# Altium schematic sheet LCD_LED.SchDoc: Air724UG 参考设计
size 594 x 419 mm; DESIGNER: Loukanghua; REV: V1.0
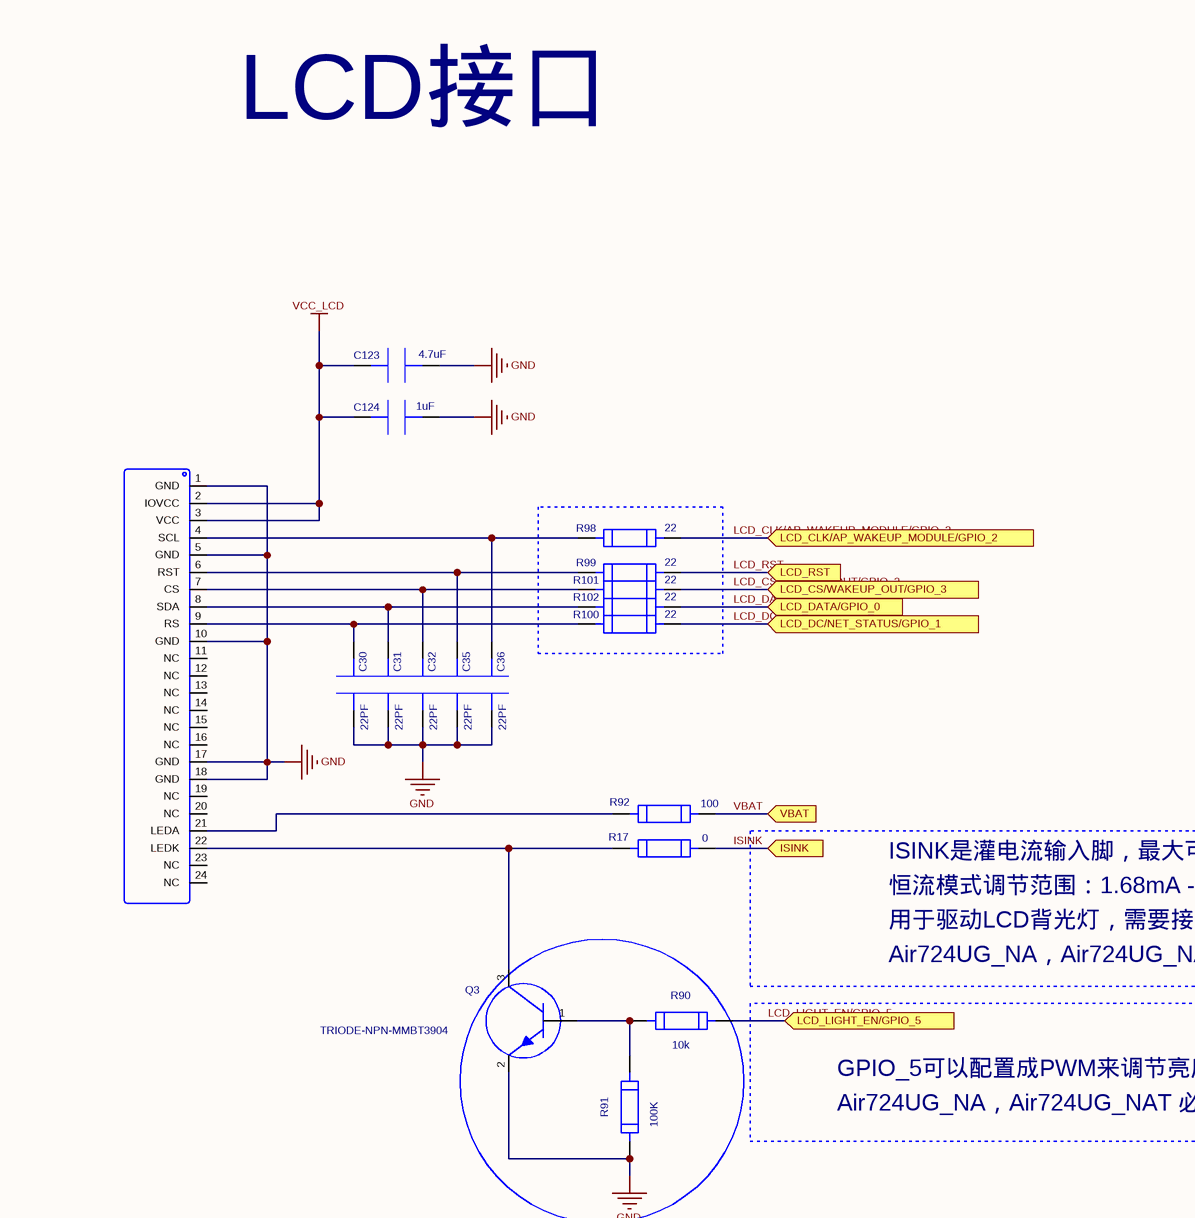
[diagram p0: LCD_LED.SchDoc, top left]
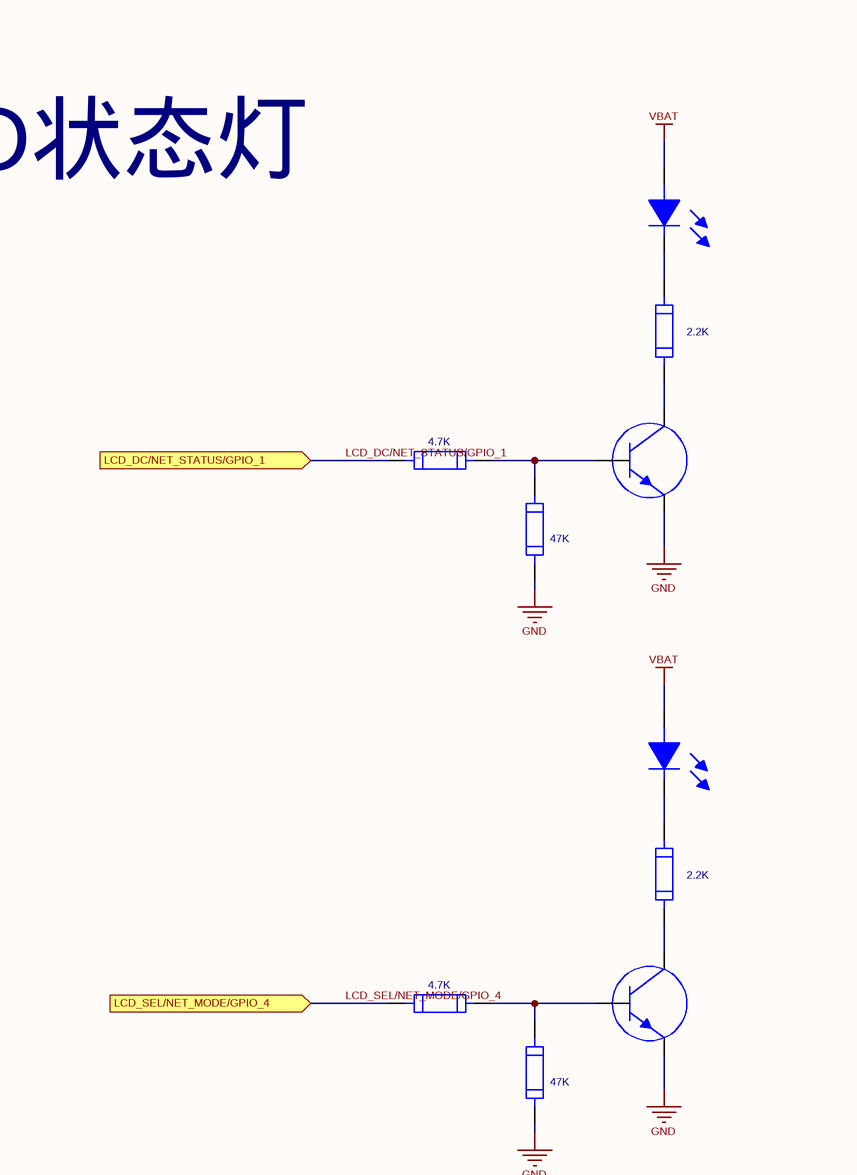
[diagram p1: LCD_LED.SchDoc, top right]
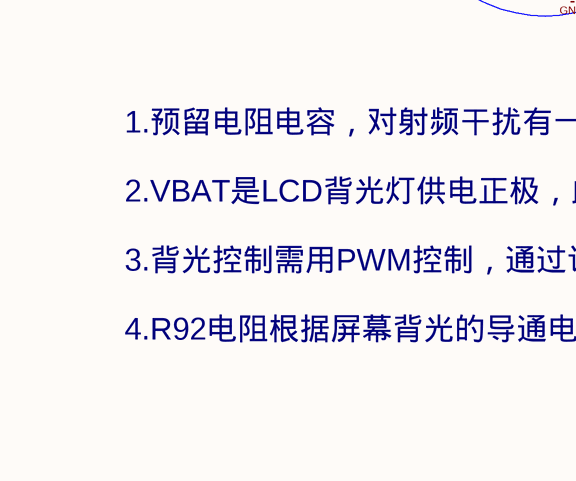
[diagram p2: LCD_LED.SchDoc, bottom left]
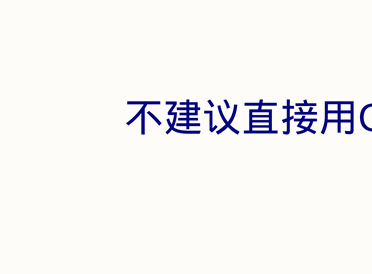
[diagram p3: LCD_LED.SchDoc, bottom middle]
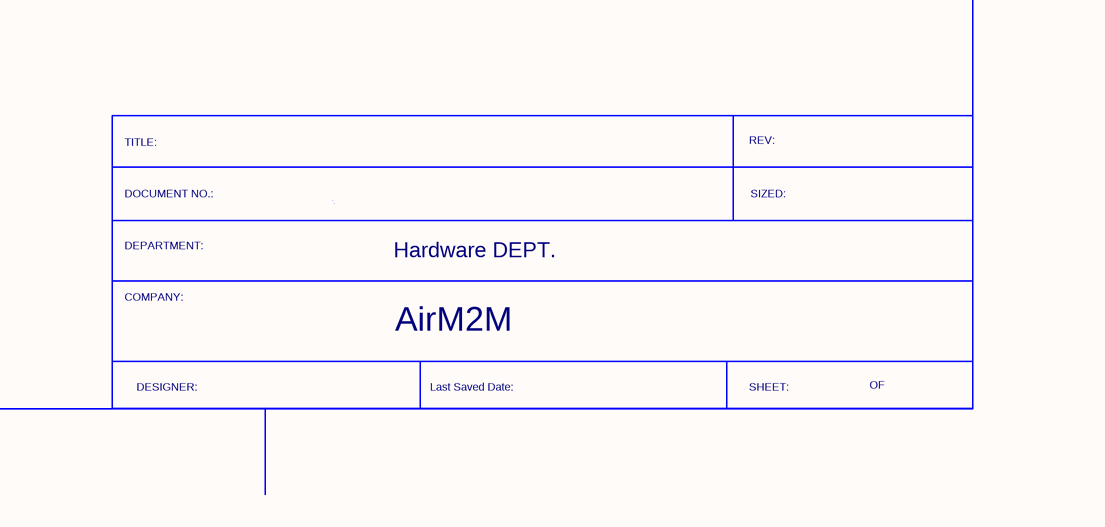
[diagram p4: LCD_LED.SchDoc, bottom right]

## Parts
C30  value 22PF  [SC0402]  (hidden comment: CAP-22PF-0402-C0G)
C31  value 22PF  [SC0402]  (hidden comment: CAP-22PF-0402-C0G)
C32  value 22PF  [SC0402]  (hidden comment: CAP-22PF-0402-C0G)
C35  value 22PF  [SC0402]  (hidden comment: CAP-22PF-0402-C0G)
C36  value 22PF  [SC0402]  (hidden comment: CAP-22PF-0402-C0G)
C123  value 4.7uF  [SC0603]  (hidden comment: CAP-4.7UF-0603-X5R)
C124  value 1uF  [SC0402]  (hidden comment: CAP-1UF-0402-X5R)
D1  DIODE-LED-RED-2.54  [DIP2X1-2.54]  (value not drawn)
D3  DIODE-LED-RED-2.54  [DIP2X1-2.54]  (value not drawn)
P6  FPC_0.5MM_24P_PULL_TYPE_H2.0MM_UNDER_THE  [FPC-SMD_AFC07-S24FCC-00]  (value not drawn)
Q3  TRIODE-NPN-MMBT3904  [SOT-23(MMBT3904)]
Q5  TRIODE-NPN-MMBT3904  [SOT-23(MMBT3904)]  (value not drawn)
Q6  TRIODE-NPN-MMBT3904  [SOT-23(MMBT3904)]  (value not drawn)
R17  value 0  [SR0402]  (hidden comment: RES-0-0402)
R24  value 4.7K  [SR0402]  (hidden comment: RES-4.7K-0402)
R30  value 47K  [SR0402]  (hidden comment: RES-4.7K-0402)
R31  value 2.2K  [SR0402]  (hidden comment: RES-4.7K-0402)
R32  value 4.7K  [SR0402]  (hidden comment: RES-4.7K-0402)
R33  value 47K  [SR0402]  (hidden comment: RES-4.7K-0402)
R34  value 2.2K  [SR0402]  (hidden comment: RES-4.7K-0402)
R90  value 10k  [SR0402]  (hidden comment: RES-10K-0402)
R91  value 100K  [SR0402]  (hidden comment: RES-100K-0402)
R92  value 100  [SR0603]  (hidden comment: RES-100-0603)
R98  value 22  [SR0402]  (hidden comment: RES-22-0402)
R99  value 22  [SR0402]  (hidden comment: RES-22-0402)
R100  value 22  [SR0402]  (hidden comment: RES-22-0402)
R101  value 22  [SR0402]  (hidden comment: RES-22-0402)
R102  value 22  [SR0402]  (hidden comment: RES-22-0402)

## Blocks framed on the sheet
LCD接口: C30-C32 C35 C36 C123 C124 P6 Q3 R17 R90-R92 R98-R102
LED状态灯: D1 D3 Q5 Q6 R24 R30-R34

## Ports
ISINK, LCD_CLK/AP_WAKEUP_MODULE/GPIO_2, LCD_CS/WAKEUP_OUT/GPIO_3, LCD_DATA/GPIO_0, LCD_DC/NET_STATUS/GPIO_1, LCD_LIGHT_EN/GPIO_5, LCD_RST, LCD_SEL/NET_MODE/GPIO_4, VBAT

## Nets
GND: C30.2 C31.2 C32.2 C35.2 C36.2 C123.1 C124.1 P6.1(GND) P6.5(GND) P6.10(GND) P6.17(GND) P6.18(GND) Q3.2 Q5.2 Q6.2 R30.1 R33.1 R91.1
VBAT: D1.1 D3.1 R92.1 ; port VBAT
VCC_LCD: C123.2 C124.2 P6.2(IOVCC) P6.3(VCC)
ISINK: R17.2 ; port ISINK
LCD_CLK/AP_WAKEUP_MODULE/GPIO_2: R98.2 ; port LCD_CLK/AP_WAKEUP_MODULE/GPIO_2
LCD_CS/WAKEUP_OUT/GPIO_3: R101.2 ; port LCD_CS/WAKEUP_OUT/GPIO_3
LCD_DATA/GPIO_0: R102.2 ; port LCD_DATA/GPIO_0
LCD_DC/NET_STATUS/GPIO_1: R32.1 R100.2 ; port LCD_DC/NET_STATUS/GPIO_1
LCD_LIGHT_EN/GPIO_5: R90.2 ; port LCD_LIGHT_EN/GPIO_5
LCD_RST: R99.2 ; port LCD_RST
LCD_SEL/NET_MODE/GPIO_4: R24.1 ; port LCD_SEL/NET_MODE/GPIO_4
NetC30_1: C30.1 P6.9(RS) R100.1
NetC31_1: C31.1 P6.8(SDA) R102.1
NetC32_1: C32.1 P6.7(CS) R101.1
NetC35_1: C35.1 P6.6(RST) R99.1
NetC36_1: C36.1 P6.4(SCL) R98.1
NetD1_2: D1.2 R31.2
NetD3_2: D3.2 R34.2
NetP6_21: P6.21(LEDA) R92.2
NetP6_22: P6.22(LEDK) Q3.3 R17.1
NetQ3_1: Q3.1 R90.1 R91.2
NetQ5_1: Q5.1 R32.2 R33.2
NetQ5_3: Q5.3 R34.1
NetQ6_1: Q6.1 R24.2 R30.2
NetQ6_3: Q6.3 R31.1

Not connected (* = marked no-connect by the designer): P6 11(NC) 12(NC) 13(NC) 14(NC) 15(NC) 16(NC) 19(NC) 20(NC) 23(NC) 24(NC)

## Notes on the sheet
- ISINK是灌电流输入脚，最大可提供电流100mA，电流可调节
- 用于驱动LCD背光灯，需要接背光灯的负极
- 恒流模式调节范围：1.68mA - 54.6mA
- Air724UG_NA，Air724UG_NAT 不支持这个功能
- GPIO_5可以配置成PWM来调节亮度
- Air724UG_NA，Air724UG_NAT 必须加
- 1.预留电阻电容，对射频干扰有一定的抑制效果；
- 不建议直接用GPIO驱动LED，需要加三极管来驱动
- 2.VBAT是LCD背光灯供电正极，此电源可根据LCD模组的需求，自行设计。
- 3.背光控制需用PWM控制，通过调整PWM占空比来调整背光亮度；
- 4.R92电阻根据屏幕背光的导通电流来做调整。
- TITLE:
- REV:
- DEPARTMENT:
- DOCUMENT NO.:
- Hardware DEPT.
- SIZED:
- COMPANY:
- AirM2M
- DESIGNER:
- Last Saved Date:
- SHEET:
- OF

## Library data of the parts
C30-C32 C35 C36 = CAP-22PF-0402-C0G: CAP CER C0G;22PF;+/-5%;50V;0402;0.5mm;ROHS; Manufacture 1: MURATA;Yageo;Eyang; Manufacture 1 P/N: GRM1555C1H220J****;CC0402JRNPO9BN220;C0402C0G220J500N*; Geometry.Height: 0.55mm; Serial Number: 80214650007; Tolerance: +/-5%;; PCB DECAL: SC0402
C123 = CAP-4.7UF-0603-X5R: CAP CER X5R;4.7uF;+/-10%;6.3V;0603;0.8mm;ROHS; Manufacture 1: Murata;TDK;Yageo;Taiyo Yuden;Panasonic;Kyocera;Samsung;; Manufacture 1 P/N: GRM188R60J475K****;C1608X5R0J475K;CC0603KRX5R5BB475;JMK107BJ475KA-T;ECJ1VB0J475K;CV105X5R475K06ATCL10A475KQ8NNNC;; Geometry.Height: 0.95mm; Serial Number: 80216710002; Tolerance: +/-10%; PCB DECAL: SC0603
C124 = CAP-1UF-0402-X5R: CAP CER X5R;1uF;+/-10%;6.3V;0402;0.5mm;ROHS; Manufacture 1 P/N: GRM155R60J105K****;CC0402KRX5R5BB105;C1005X5R0J105KT;JMK105BJ105KV-F;ECJ0EB0J105K;0402X105K6R3CT;CL05A105KQ5NNNC; Manufacture 1: Murata;Yageo;TDK;Taiyo Yuden;Panasonic;Walsin;Samsung; Serial Number: 80214710001; Geometry.Height: 0.55mm; Tolerance: +/-10%; PCB DECAL: SC0402
D1 D3 = DIODE-LED-RED-2.54: LED red; PCB DECAL: DIP2X1-2.54
P6 = FPC_0.5MM_24P_PULL_TYPE_H2.0MM_UNDER_THE: BOM_Manufacturer_Part: FPC 0.5MM 24P Pull type H2.0mm Under the next; BOM_Manufacturer: ReliaPro; spiceSymbolName: FPC 0.5MM 24P Pull type H2.0mm Under the next; BOM_Supplier_Part: C11057; image: //image.lceda.cn/szlcsc/C11057.jpg; BOM_Supplier: LCSC; spicePre: X; PCB DECAL: FPC-SMD_AFC07-S24FCC-00
Q3 Q5 Q6 = TRIODE-NPN-MMBT3904: Transistor;NPN;40V;200mA;SOT23;1.1mm;ROHS; Manufacture 1: 长电; Serial Number: 81232000008; Geometry.Height: 1.1mm; Manufacture 1 P/N: MMBT3904; PCB DECAL: SOT-23(MMBT3904)
R17 = RES-0-0402: RES FILM;0;1A;0402;0.4mm;ROHS; Manufacture 1: YAGEO; Manufacture 1 P/N: RC0402JR-070RL; Serial Number: 80114640001; Geometry.Height: 0.4mm; PCB DECAL: SR0402
R24 R30-R34 = RES-4.7K-0402: RES FILM;4.7K;+/-5%;1/16W;0402;0.4mm;ROHS; Manufacture 1: YAGEO; Manufacture 1 P/N: RC0402JR-074K7L; Serial Number: 80114640017; Geometry.Height: 0.4mm; Tolerance: +/-5%; PCB DECAL: SR0402
R90 = RES-10K-0402: RES FILM;10K;+/-5%;1/16W;0402;0.4mm;ROHS; Manufacture 1: YAGEO;Walsin; Manufacture 1 P/N: RC0402JR-0710KL;WR04X103_JTL; Designator: R; Serial Number: 80114640004; Package: 0402; PCB DECAL: SR0402; Geometry.Height: 0.4mm; Tolerance: +/-5%
R91 = RES-100K-0402: RES FILM;100K;+/-5%;1/16W;0402;0.4mm;ROHS; Manufacture 1 P/N: RC0402JR-07100KL;WR04X104_JTL;; Manufacture 1: YAGEO;Walsin; Geometry.Height: 0.40mm; Serial Number: 80114640005; Tolerance: +/-5%; PCB DECAL: SR0402
R92 = RES-100-0603: RES FILM;100;+/-5%;1/10W;0603;0.55mm;ROHS; Manufacture 1: YAGEO; Manufacture 1 P/N: RC0603JR-07100RL; Serial Number: 80116630002; Tolerance: +/-5%; Geometry.Height: 0.55mm; PCB DECAL: SR0603
R98-R102 = RES-22-0402: RES FILM;22;+/-5%;1/16W;0402;0.4mm;ROHS; Manufacture 1 P/N: RC0402JR-0722RL; Manufacture 1: YAGEO; Serial Number: 80114640035; Geometry.Height: 0.4mm; Tolerance: +/-5%; PCB DECAL: SR0402